# EAGLE design simduino (EAGLE 5.11)
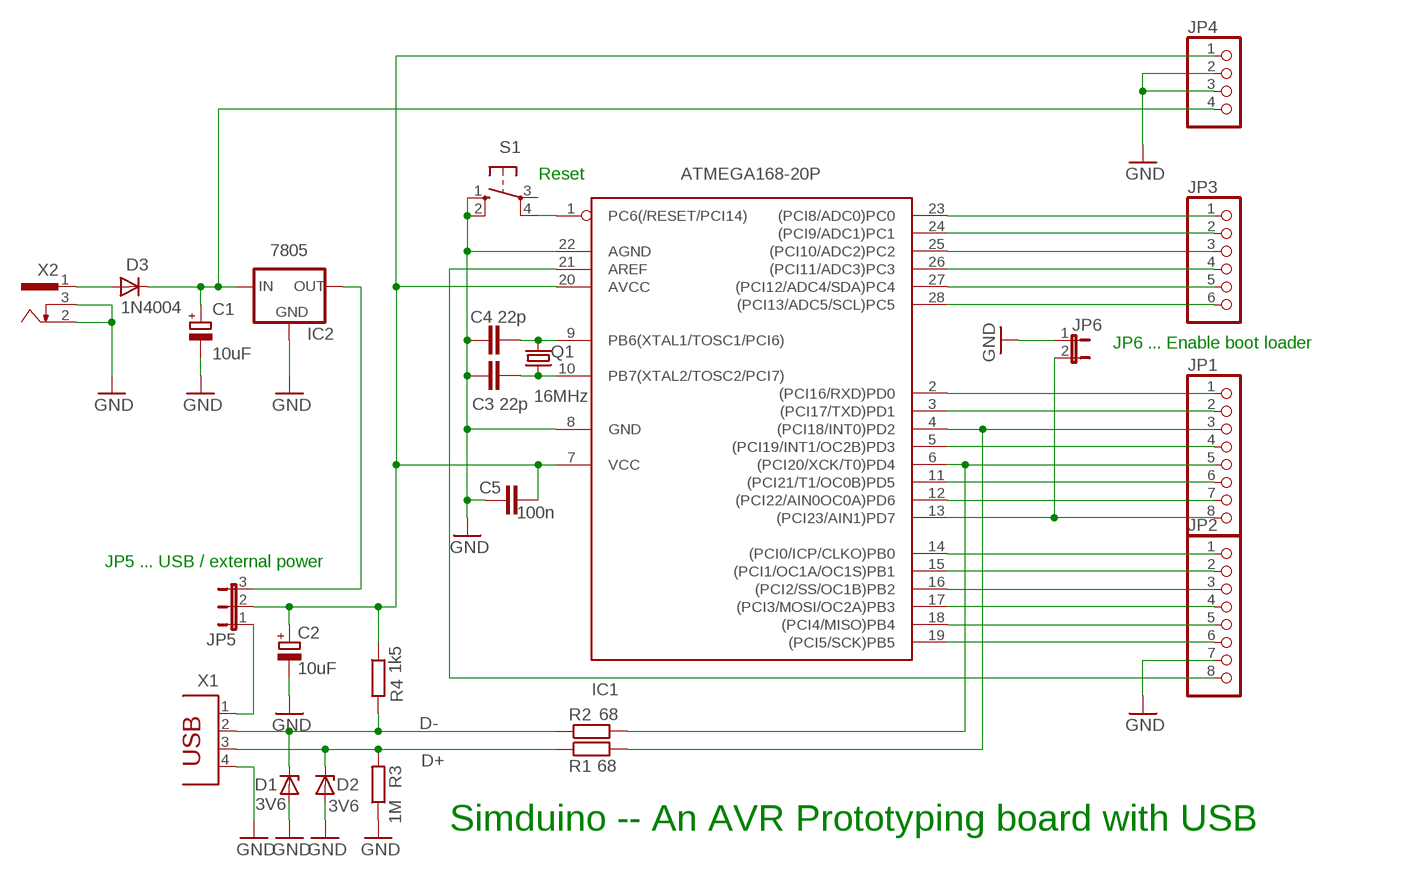
[diagram p0: schematic, sheet 1]

## Parts
C1  10uF  CPOL-EUE2,5-6E  [E2,5-6E]
C2  10uF  CPOL-EUE2,5-6E  [E2,5-6E]
C3  22p  C-EU025-024X044  [C025-024X044]
C4  22p  C-EU025-024X044  [C025-024X044]
C5  100n  C-EU025_050-025X075  [C025_050-025X075]
D1  3V6  ZENER-DIODEDO34-7  [DO34Z7]
D2  3V6  ZENER-DIODEDO34-7  [DO34Z7]
D3  1N4004  [DO41-10]
IC1  ATMEGA168-20P  [DIL28-3]
IC2  7805  78XXL  [78XXL]
JP1  PINHD-1X8  [1X08]
JP2  PINHD-1X8  [1X08]
JP3  PINHD-1X6  [1X06]
JP4  PINHD-1X4  [1X04]
JP5  JP2E  [JP2]
JP6  JP1E  [JP1]
Q1  16MHz  CRYSTALHC49S  [HC49/S]
R1  68  R-EU_0207/10  [0207/10]
R2  68  R-EU_0207/10  [0207/10]
R3  1M  R-EU_0207/10  [0207/10]
R4  1k5  R-EU_0207/10  [0207/10]
S1  10-XX  [B3F-10XX]
X1  PN61729  [PN61729]
X2  733980-62  [733980-62]

## Nets
+5USB: JP5.1 X1.1
+5V: C2.+ C5.2 IC1.7(VCC) IC1.20(AVCC) JP4.1 JP5.2 R4.1
+VRAW: C1.+ D3.C IC2.IN JP4.4
D+: D2.C R1.1 R3.2 X1.3
D-: D1.C R2.1 R4.2 X1.2
GND: C1.- C2.- C3.1 C4.1 C5.1 D1.A D2.A IC1.8(GND) IC1.22(AGND) IC2.GND JP2.7 JP4.2 JP4.3 JP6.1 R3.1 S1.1(S) S1.2(S1) X1.4 X2.2 X2.3
N$1: IC1.6((PCI20/XCK/T0)PD4) JP1.5 R2.2
N$2: IC1.1(PC6(/RESET/PCI14)) S1.4(P1)
N$3: IC1.4((PCI18/INT0)PD2) JP1.3 R1.2
N$4: D3.A X2.1
N$6: IC1.2((PCI16/RXD)PD0) JP1.1
N$8: IC2.OUT JP5.3
N$9: C3.2 IC1.10(PB7(XTAL2/TOSC2/PCI7)) Q1.1
N$10: C4.2 IC1.9(PB6(XTAL1/TOSC1/PCI6)) Q1.2
N$11: IC1.3((PCI17/TXD)PD1) JP1.2
N$12: IC1.5((PCI19/INT1/OC2B)PD3) JP1.4
N$13: IC1.11((PCI21/T1/OC0B)PD5) JP1.6
N$14: IC1.12((PCI22/AIN0OC0A)PD6) JP1.7
N$15: IC1.13((PCI23/AIN1)PD7) JP1.8 JP6.2
N$16: IC1.23((PCI8/ADC0)PC0) JP3.1
N$17: IC1.24((PCI9/ADC1)PC1) JP3.2
N$18: IC1.25((PCI10/ADC2)PC2) JP3.3
N$19: IC1.26((PCI11/ADC3)PC3) JP3.4
N$20: IC1.27((PCI12/ADC4/SDA)PC4) JP3.5
N$21: IC1.28((PCI13/ADC5/SCL)PC5) JP3.6
N$22: IC1.14((PCI0/ICP/CLKO)PB0) JP2.1
N$23: IC1.15((PCI1/OC1A/OC1S)PB1) JP2.2
N$24: IC1.16((PCI2/SS/OC1B)PB2) JP2.3
N$25: IC1.17((PCI3/MOSI/OC2A)PB3) JP2.4
N$26: IC1.18((PCI4/MISO)PB4) JP2.5
N$27: IC1.19((PCI5/SCK)PB5) JP2.6
N$28: IC1.21(AREF) JP2.8
Unconnected: S1.3(P)

## Notes on the sheet
- Reset
- JP6 ... Enable boot loader
- JP5 ... USB / external power
- Simduino -- An AVR Prototyping board with USB

## Library data of the parts
C1 C2 = rcl:CPOL-EU: POLARIZED CAPACITOR, European symbol
C3-C5 = rcl:C-EU: CAPACITOR, European symbol
D1 D2 = diode:ZENER-DIODE: Z-Diode
D3 = diode:1N4004: DIODE general purpose rectifier, 1 A
IC1 = avr:ATMEGA168*P: MICROCONTROLLER 16 kBytes FLASH 1 kBytes SRAM 512 Bytes EEPROM USART 8-channel 10 bit ADC
IC2 = v-reg:78XXL: VOLTAGE REGULATOR
JP1 JP2 = pinhead:PINHD-1X8: PIN HEADER
JP3 = pinhead:PINHD-1X6: PIN HEADER
JP4 = pinhead:PINHD-1X4: PIN HEADER
JP5 = jumper:JP2E: JUMPER
JP6 = jumper:JP1E: JUMPER
Q1 = crystal:CRYSTAL: CRYSTAL
R1-R4 = rcl:R-EU_: RESISTOR, European symbol
S1 = switch-omron:10-XX: OMRON SWITCH
X1 = con-berg:PN61729: BERG USB connector
X2 = con-conrad:73398?: FEMALE PRINT CONNECTOR Niedervolt-Steckverbinder Distributor Conrad

## Board
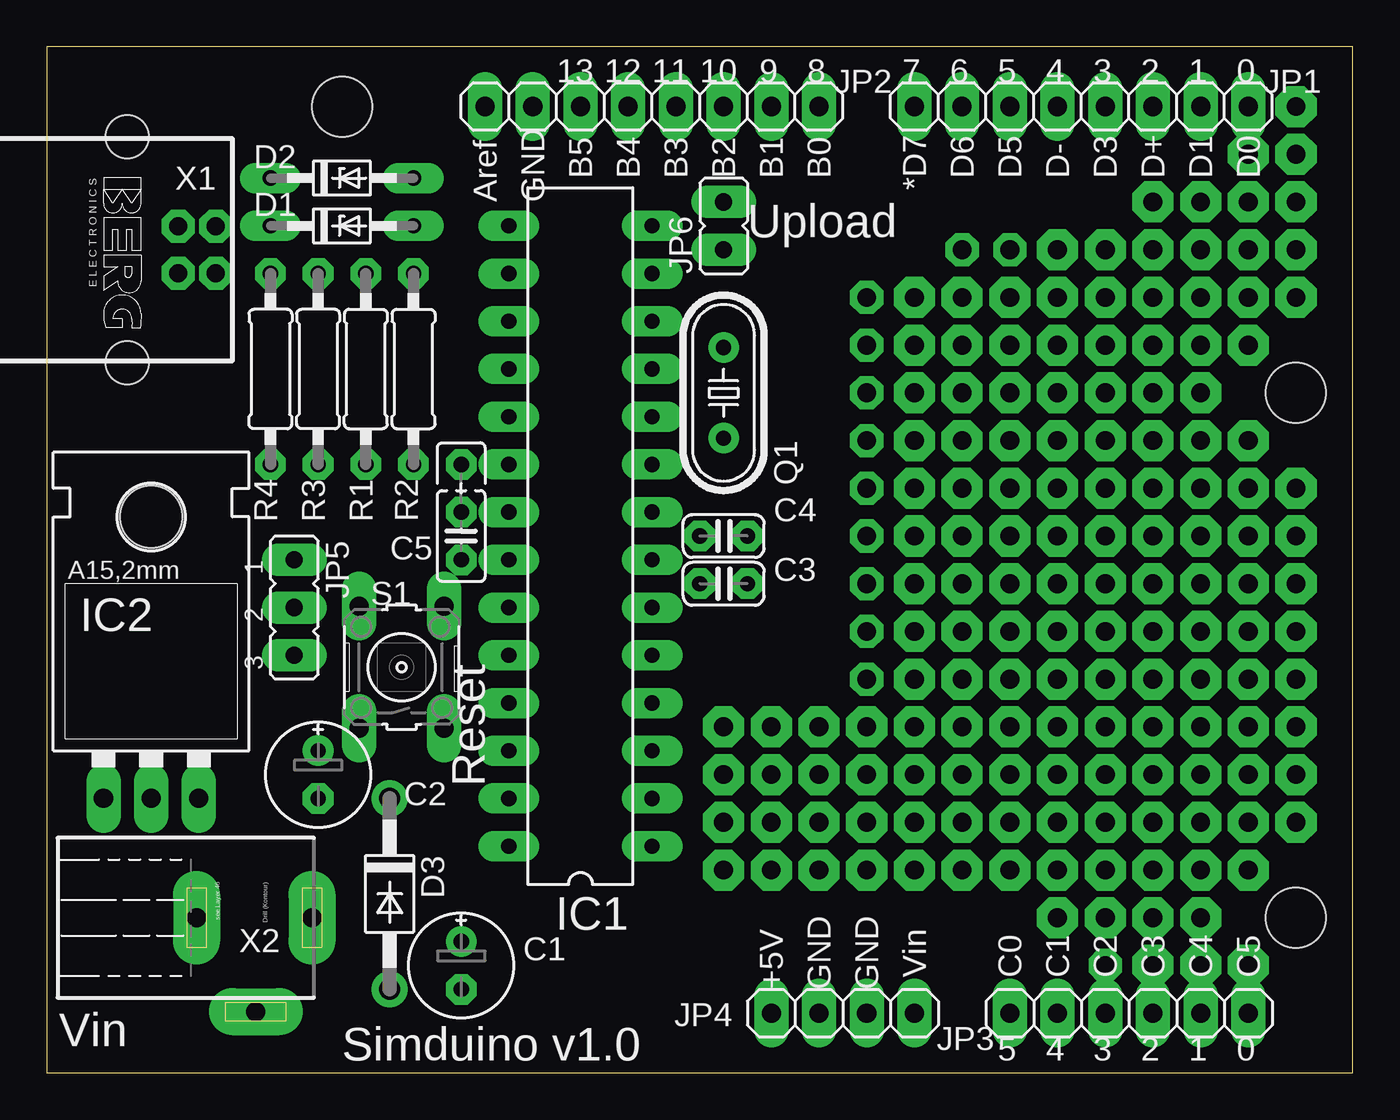
[diagram p1: board, top side]
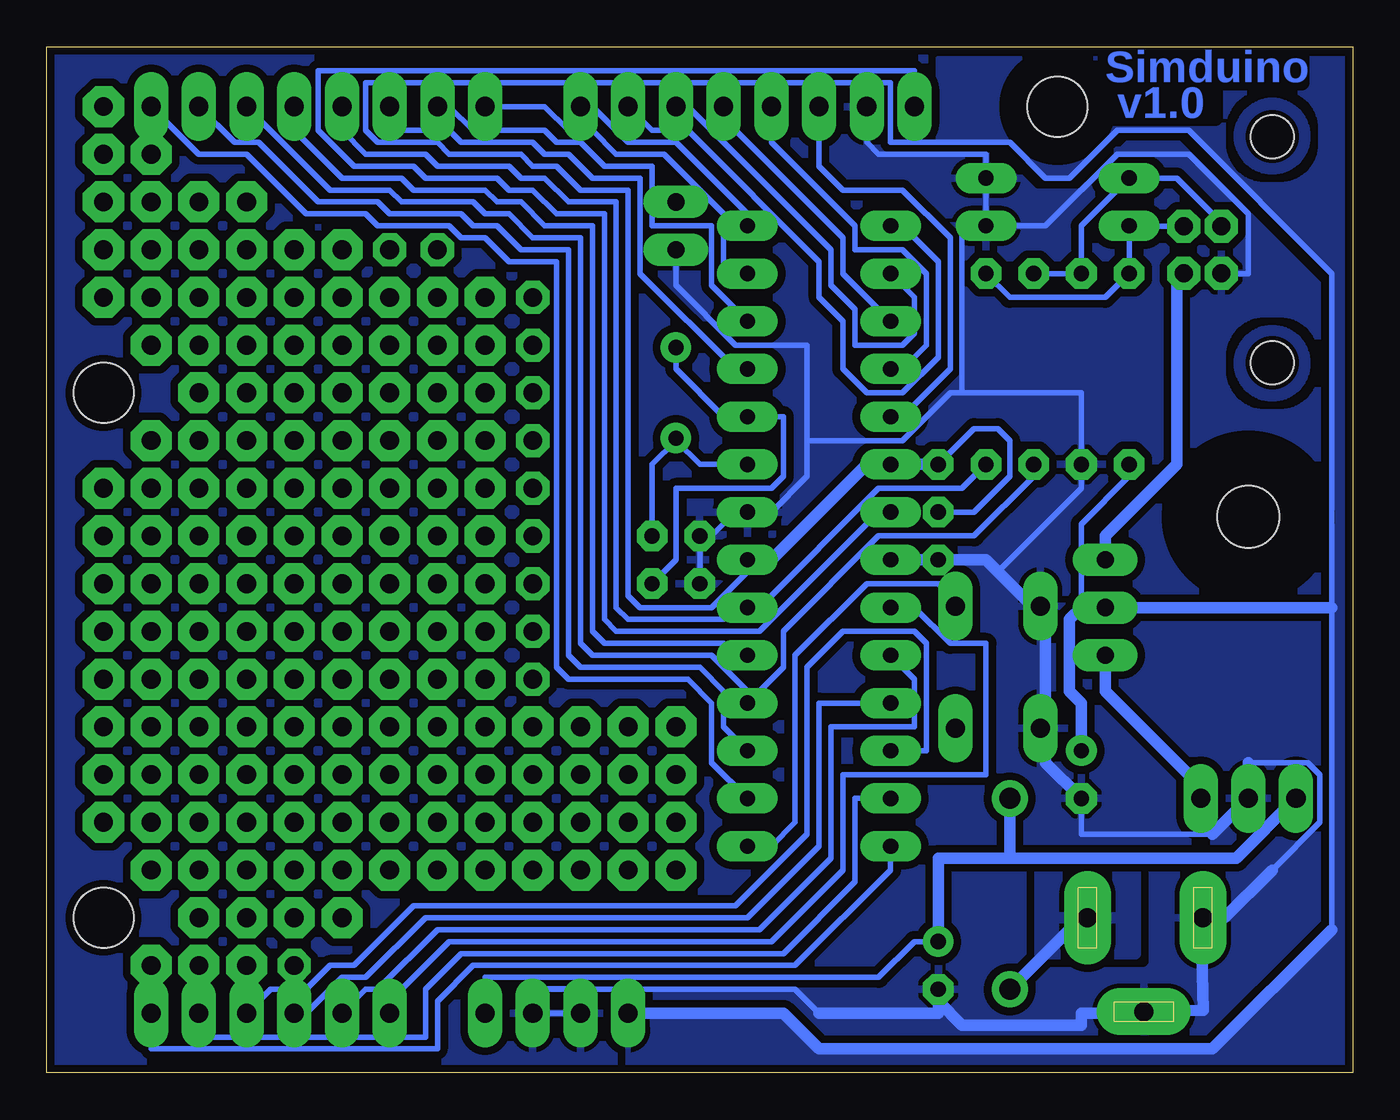
[diagram p2: board, bottom side, seen from below]

Size 69.52 x 54.6 mm. Coordinates in mm from the lower left corner, seen from the top.
Outline: 0,0 69.52,0 69.52,54.6 0,54.6 0,0
Copper layers (1*16): Top 0.035mm / dielectric 1.5mm / Bottom 0.035mm
Design rules "mine": minimum track width 12mil, minimum drill 31mil, track to track 8mil, track to pad 8mil, pad to pad 8mil, via to via 8mil, smd to smd 8mil, copper to edge 10mil, drill to drill 20mil, minimum pad ring 16mil, minimum via ring 15mil, stop-mask expansion 4mil, vias tented up to drill 0mil, thermal gap 10mil
Holes 3.2 mm at 66.51,36.19 66.51,8.25 15.71,51.43
bRestrict: area 13,48.7 to 18.4,54.1

### Footprints (pad centres in the part's own frame; a part is rotated, then mirrored left to right if it is on the bottom)
E2,5-6E = drill 0.813 pad 1.575 round: + -1.27,0 | drill 0.813 pad 1.575 octagon: - 1.27,0
C025-024X044 = drill 0.813 octagon: 1 -1.27,0; 2 1.27,0
C025_050-025X075 = drill 0.813 octagon: 1 -1.27,0; 2 1.27,0; 3 3.81,0
DO34Z7 = drill 0.813 long: A 3.81,0; C -3.81,0
DO41-10 = drill 1.118 round: A 5.08,0; C -5.08,0
DIL28-3 = drill 0.813 long: 1 -16.51,-3.81; 2 -13.97,-3.81; 3 -11.43,-3.81; 4 -8.89,-3.81; 5 -6.35,-3.81; 6 -3.81,-3.81; 7 -1.27,-3.81; 8 1.27,-3.81; 9 3.81,-3.81; 10 6.35,-3.81; 11 8.89,-3.81; 12 11.43,-3.81; 13 13.97,-3.81; 14 16.51,-3.81; 15 16.51,3.81; 16 13.97,3.81; 17 11.43,3.81; 18 8.89,3.81; 19 6.35,3.81; 20 3.81,3.81; 21 1.27,3.81; 22 -1.27,3.81; 23 -3.81,3.81; 24 -6.35,3.81; 25 -8.89,3.81; 26 -11.43,3.81; 27 -13.97,3.81; 28 -16.51,3.81
78XXL = drill 1.016 long: GND 0,-3.81; IN -2.54,-3.81; OUT 2.54,-3.81 | hole 3.302: 0,11.176
1X08 = drill 1.016 long: 1 -8.89,0; 2 -6.35,0; 3 -3.81,0; 4 -1.27,0; 5 1.27,0; 6 3.81,0; 7 6.35,0; 8 8.89,0
1X06 = drill 1.016 long: 1 -6.35,0; 2 -3.81,0; 3 -1.27,0; 4 1.27,0; 5 3.81,0; 6 6.35,0
1X04 = drill 1.016 long: 1 -3.81,0; 2 -1.27,0; 3 1.27,0; 4 3.81,0
JP2 = drill 0.914 long: 1 -2.54,0; 2 0,0; 3 2.54,0
JP1 = drill 0.914 long: 1 0,-1.27; 2 0,1.27
HC49/S = drill 0.813 round: 1 -2.413,0; 2 2.413,0
0207/10 = drill 0.813 octagon: 1 -5.08,0; 2 5.08,0
B3F-10XX = drill 1.016 long: 1 -3.251,2.261; 2 3.251,2.261; 3 -3.251,-2.261; 4 3.251,-2.261
PN61729 = drill 0.95 octagon: 1 1.25,4.71; 2 -1.25,4.71; 3 -1.25,2.71; 4 1.25,2.71 | hole 2.3: -6.02,0; 6.02,0
733980-62 = drill 1 pad 2.5 long: 1 0,8.57; 2 0,2.42; 3 5,5.57

### Placement (x,y rotation side)
C1  22.06,5.71 270 top
C2  14.44,15.87 270 top
C3  36.03,26.03 0 top
C4  36.03,28.57 0 top
C5  22.06,28.57 90 top
D1  15.71,45.08 0 top
D2  15.71,47.62 0 top
D3  18.25,9.52 270 top
IC1  28.41,28.57 90 top
IC2  5.55,18.41 0 top
JP1  55.08,51.43 180 top
JP2  32.22,51.43 180 top
JP3  57.62,3.17 0 top
JP4  42.38,3.17 0 top
JP5  13.17,24.76 270 top
JP6  36.03,45.08 0 top
Q1  36.03,36.19 270 top
R1  16.98,37.46 270 top
R2  19.52,37.46 270 top
R3  14.44,37.46 90 top
R4  11.9,37.46 90 top
S1  18.88,21.58 90 top
X1  4.28,43.81 270 top
X2  5.55,8.25 270 top

### Tracks (layer width: path | path; a pad name or v marks a point on that pad's centre or on a via)
+5USB
  Bottom 0.61: JP5.1 13.17,28.57 9.36,32.38 9.36,41.91 X1.1
+5V
  Bottom 0.305: IC1.7 32.22,26.66 34.12,24.76 37.94,24.76 38.57,25.39 38.57,46.98 41.11,46.98 42.38,48.26 43.65,48.26 44.28,48.89 48.09,48.89 48.73,49.53 51.91,49.53 52.54,50.16 52.54,52.7 24.6,52.7 24.6,49.53 18.25,49.53 16.34,47.62 15.08,47.62 12.54,50.16 8.73,50.16 1.1,42.54 1.1,24.76 1.1,7.62 | 14.44,24.76 14.44,29.2 11.9,31.74 R4.1 | C5.2 20.15,29.84 18.25,31.74 18.25,33.65 18.88,34.29 20.15,34.29 22.06,32.38
  Bottom 0.61: IC1.7 30.95,27.3 25.87,32.38 IC1.20 22.06,32.38 | JP4.1 30.31,3.17 28.41,1.27 7.46,1.27 1.1,7.62 | C2.+ 14.44,19.68 15.08,20.31 15.08,24.12 14.44,24.76 JP5.2 1.1,24.76
  pour Bottom (isolate 0.406): 0.47,42.54 0.47,7.62 1.1,7.62 1.1,42.54
  pour Bottom (isolate 0.406, rank 2): 0.47,42.54 0.47,53.97 22.06,53.97 22.06,49.53 18.25,49.53 16.34,47.62 15.08,47.62 12.54,50.16 8.73,50.16 1.1,42.54
  pour Bottom (isolate 0.406, rank 2): 1.74,6.98 7.46,1.27 28.41,1.27 30.31,3.17 38.57,3.17 38.57,-0.01 -0.17,-0.01 -0.17,7.62 1.1,7.62
+VRAW
  Bottom 0.305: JP4.4 46.19,5.08 25.23,5.08 23.33,6.98 C1.+
  Bottom 0.61: IC2.IN 6.18,11.43 18.25,11.43 | 18.25,11.43 22.06,11.43 C1.+ | 18.25,11.43 D3.C
D+
  Bottom 0.305: R1.1 R3.2 14.44,45.08 D2.C 9.36,47.62 6.99,45.25 X1.3
D-
  Bottom 0.305: R2.1 18.25,41.27 13.17,41.27 R4.2 11.88,42.56 11.88,45.06 | 11.88,45.06 X1.2 | 11.88,45.06 D1.C
GND
  Bottom 0.305: C5.1 IC1.22 | JP4.3 JP4.2 41.11,4.44 29.68,4.44 28.41,3.17 | C2.- 14.44,12.7 7.46,12.7 | 5.55,16.5 2.38,16.5 1.74,15.87 1.74,13.33 4.28,10.79 | C3.1 C4.1 34.12,28.57 32.85,29.84 IC1.8 30.95,29.84 29.04,31.74 29.04,33.65 | JP6.1 36.03,41.91 32.85,38.73 29.04,38.73 29.04,33.65 | 29.04,33.65 23.96,33.65 21.42,36.19 20.79,36.19 | JP2.7 25.87,49.53 25.23,48.89 19.52,48.89 D2.A | 20.79,36.19 14.44,36.19 R3.1 14.44,31.11 18.88,26.66 | 20.79,36.19 20.79,45.08 D1.A | D1.A D2.A | D1.A D2.A | D1.A 16.34,45.08 12.54,48.89 8.73,48.89 5.55,45.72 5.55,42.54 6.82,42.54 X1.4
  Bottom 0.308: 41.11,4.44 43.65,4.44 JP4.3
  Bottom 0.61: IC1.22 C5.1 19.52,27.3 18.88,26.66 16.98,24.76 | S1.2 16.9,24.84 16.98,24.76 | 16.98,24.76 16.34,24.12 16.34,18.41 | S1.1 16.42,18.33 16.34,18.41 | 16.34,18.41 16.34,16.5 C2.- | 28.41,3.17 22.06,3.17 C1.- 22.06,3.8 20.79,2.54 14.44,2.54 14.44,3.17 11.27,3.17 11.19,3.25 X2.3 7.94,3.31 8.09,8.25 | 7.46,12.7 IC2.GND 5.55,16.5 | 4.28,10.79 6.82,8.25 8.09,8.25 | 8.09,8.25 X2.2
  pour Bottom (isolate 0.406, rank 3): -0.17,54.61 69.69,54.61 69.69,-0.01 -0.17,-0.01
N$1
  Bottom 0.305: JP1.5 53.81,50.16 52.54,48.89 49.37,48.89 48.73,48.26 44.92,48.26 44.28,47.62 43.02,47.62 41.74,46.35 39.2,46.35 39.2,24.76 38.57,24.12 33.49,24.12 32.85,24.76 IC1.6 31.58,24.76 25.23,31.11 20.79,31.11 R2.2
N$2
  Bottom 0.305: IC1.1 30.95,12.06 29.68,13.33 29.68,22.22 25.87,26.03 22.06,26.03 21.42,25.39 S1.4
N$3
  Bottom 0.305: JP1.3 54.45,46.98 51.27,46.98 50.63,46.35 46.82,46.35 46.19,45.72 44.92,45.72 43.65,44.45 41.11,44.45 41.11,22.86 40.48,22.22 34.12,22.22 32.22,20.31 IC1.4 30.31,21.58 30.31,23.49 25.23,28.57 20.15,28.57 16.98,31.74 R1.2
N$4
  Bottom 0.61: X2.1 14.44,8.25 D3.A
  pour Bottom (isolate 0.406): 11.57,10.79 16.65,10.79 16.65,6.34 11.57,6.34
N$5  (via drill 1 pad 2.18)
  other vias: 63.97,48.89
N$6
  Bottom 0.305: IC1.2 34.12,16.5 34.12,19.68 35.39,20.95 41.74,20.95 42.38,21.58 42.38,43.18 44.92,43.18 46.19,44.45 47.46,44.45 48.09,45.08 51.91,45.08 52.54,45.72 55.71,45.72 58.89,48.89 61.43,48.89 JP1.1
N$7  (via drill 1 pad 2.18)
  other vias: 63.97,46.35
N$8
  Bottom 0.61: JP5.3 13.17,20.31 8.09,15.24 IC2.OUT
N$9
  Bottom 0.305: 36.03,38.73 Q1.1 36.03,37.46 33.49,34.92 IC1.10 30.31,34.92 30.31,31.74 30.95,31.11 36.03,31.11 36.03,27.3 C3.2
N$10
  Bottom 0.305: IC1.9 34.76,32.38 36.03,33.65 | 36.03,33.65 Q1.2 | C4.2 37.3,32.38 36.03,33.65
N$11
  Bottom 0.305: IC1.3 33.49,18.41 33.49,20.31 34.76,21.58 41.11,21.58 41.74,22.22 41.74,43.81 44.28,43.81 45.55,45.08 46.82,45.08 47.46,45.72 51.27,45.72 51.91,46.35 55.08,46.35 58.25,49.53 59.52,49.53 JP1.2
N$12
  Bottom 0.305: IC1.5 32.85,22.22 33.49,22.86 39.84,22.86 40.48,23.49 40.48,45.08 43.02,45.08 44.28,46.35 45.55,46.35 46.19,46.98 50,46.98 50.63,47.62 53.81,47.62 56.35,50.16 JP1.4
N$13
  Bottom 0.305: JP1.6 51.27,50.16 48.09,50.16 47.46,49.53 43.65,49.53 43.02,48.89 41.74,48.89 40.48,47.62 37.94,47.62 37.94,42.54 32.85,37.46 IC1.11
N$14
  Bottom 0.305: JP1.7 48.09,51.43 46.82,50.16 43.02,50.16 42.38,49.53 41.11,49.53 39.84,48.26 37.3,48.26 37.3,45.08 34.12,45.08 34.12,41.91 IC1.12
N$15
  Bottom 0.305: IC1.13 33.49,42.54 33.49,45.72 34.76,46.98 | JP1.8 43.02,51.43 41.74,50.16 40.48,50.16 39.2,48.89 36.66,48.89 34.76,46.98 | JP6.2 35.39,46.35 34.76,46.98
N$16
  Bottom 0.305: IC1.23 23.33,24.76 21.42,22.86 19.52,22.86 19.52,15.87 27.14,15.87 27.14,10.79 30.95,6.98 48.09,6.98 51.27,3.8 JP3.1
N$17
  Bottom 0.305: IC1.24 23.33,20.95 23.33,18.41 27.77,18.41 27.77,11.43 31.58,7.62 48.73,7.62 51.91,4.44 52.54,4.44 JP3.2
N$18
  Bottom 0.305: JP3.3 55.71,3.17 53.81,5.08 52.54,5.08 49.37,8.25 32.22,8.25 28.41,12.06 28.41,19.68 IC1.25
N$19
  Bottom 0.305: IC1.26 22.7,17.14 22.7,22.86 23.33,23.49 27.14,23.49 29.04,21.58 29.04,12.7 32.85,8.89 50,8.89 53.17,5.71 54.45,5.71 55.71,4.44 57.62,4.44 JP3.4
N$20
  Bottom 0.305: IC1.27 26.5,14.6 26.5,10.16 30.31,6.34 47.46,6.34 49.37,4.44 49.37,1.9 61.43,1.9 JP3.5
N$21
  Bottom 0.305: IC1.28 24.6,10.79 29.68,5.71 46.82,5.71 48.73,3.8 48.73,1.27 63.97,1.27 JP3.6
N$22
  Bottom 0.305: IC1.14 32.22,45.72 36.03,49.53 38.57,49.53 40.48,51.43 JP2.1
N$23
  Bottom 0.305: JP2.2 37.3,50.16 35.39,50.16 28.41,43.18 28.41,41.27 27.14,40 27.14,37.46 25.87,36.19 23.96,36.19 22.06,38.1 22.06,43.18 23.96,45.08 IC1.15
N$24
  Bottom 0.305: JP2.3 35.39,51.43 27.77,43.81 27.77,41.91 26.5,40.64 26.5,38.73 23.96,38.73 23.33,39.37 23.33,41.27 IC1.16
N$25
  Bottom 0.305: IC1.17 27.14,42.54 27.14,44.45 33.49,50.8 JP2.4
N$26
  Bottom 0.305: IC1.18 23.96,37.46 22.7,38.73 22.7,42.54 23.96,43.81 26.5,43.81 26.5,45.08 30.95,49.53 JP2.5
N$27
  Bottom 0.305: IC1.19 23.96,34.92 21.42,37.46 21.42,44.45 23.96,46.98 27.14,46.98 28.41,48.26 JP2.6
N$28
  Bottom 0.305: IC1.21 25.23,29.84 31.58,23.49 39.2,23.49 39.84,24.12 39.84,45.72 42.38,45.72 43.65,46.98 44.92,46.98 45.55,47.62 49.37,47.62 50,48.26 53.17,48.26 55.08,50.16 55.08,53.34 23.33,53.34 JP2.8
N$29  (via drill 1 pad 2.18)
  other vias: 63.97,43.81
N$30  (via drill 1 pad 2.18)
  other vias: 63.97,41.27
N$31  (via drill 1 pad 2.18)
  other vias: 66.51,41.27
N$32  (via drill 1 pad 2.18)
  other vias: 66.51,43.81
N$33  (via drill 1 pad 2.18)
  other vias: 66.51,46.35
N$34  (via drill 1 pad 2.18)
  other vias: 66.51,48.89
N$35  (via drill 1 pad 2.18)
  other vias: 63.97,38.73
N$36  (via drill 1 pad 2.18)
  other vias: 61.43,38.73
N$37  (via drill 1 pad 2.18)
  other vias: 61.43,41.27
N$38  (via drill 1 pad 2.18)
  other vias: 61.43,43.81
N$39  (via drill 1 pad 2.18)
  other vias: 61.43,46.35
N$40  (via drill 1 pad 2.18)
  other vias: 58.89,46.35
N$41  (via drill 1 pad 2.18)
  other vias: 58.89,43.81
N$42  (via drill 1 pad 2.18)
  other vias: 58.89,41.27
N$43  (via drill 1 pad 2.18)
  other vias: 58.89,38.73
N$44  (via drill 1 pad 2.18)
  other vias: 56.35,38.73
N$45  (via drill 1 pad 2.18)
  other vias: 56.35,41.27
N$46  (via drill 1 pad 2.18)
  other vias: 56.35,43.81
N$47  (via drill 1 pad 2.18)
  other vias: 53.81,41.27
N$48  (via drill 1 pad 2.18)
  other vias: 53.81,38.73
N$49  (via drill 1 pad 2.18)
  other vias: 51.27,38.73
N$50  (via drill 1 pad 2.18)
  other vias: 51.27,41.27
N$51  (via drill 1 pad 2.18)
  other vias: 48.73,41.27
N$52  (via drill 1 pad 2.18)
  other vias: 46.19,41.27
N$53  (via drill 1 pad 2.18)
  other vias: 46.19,38.73
N$54  (via drill 1 pad 2.18)
  other vias: 48.73,38.73
N$55  (via drill 1 pad 2.18)
  other vias: 46.19,36.19
N$56  (via drill 1 pad 2.18)
  other vias: 48.73,36.19
N$57  (via drill 1 pad 2.18)
  other vias: 51.27,36.19
N$58  (via drill 1 pad 2.18)
  other vias: 53.81,36.19
N$59  (via drill 1 pad 2.18)
  other vias: 56.35,36.19
N$60  (via drill 1 pad 2.18)
  other vias: 58.89,36.19
N$61  (via drill 1 pad 2.18)
  other vias: 61.43,36.19
N$62  (via drill 1)
  other vias: 56.35,5.71
N$63  (via drill 1 pad 2.18)
  other vias: 46.19,26.03
N$64  (via drill 1 pad 2.18)
  other vias: 46.19,33.65
N$65  (via drill 1 pad 2.18)
  other vias: 48.73,33.65
N$66  (via drill 1 pad 2.18)
  other vias: 51.27,33.65
N$67  (via drill 1 pad 2.18)
  other vias: 53.81,33.65
N$68  (via drill 1 pad 2.18)
  other vias: 56.35,33.65
N$69  (via drill 1 pad 2.18)
  other vias: 58.89,33.65
N$70  (via drill 1 pad 2.18)
  other vias: 61.43,33.65
N$71  (via drill 1 pad 2.18)
  other vias: 63.97,33.65
N$72  (via drill 1)
  other vias: 43.65,41.27
N$73  (via drill 1 pad 2.18)
  other vias: 46.19,31.11
N$74  (via drill 1 pad 2.18)
  other vias: 48.73,31.11
N$75  (via drill 1 pad 2.18)
  other vias: 51.27,31.11
N$76  (via drill 1 pad 2.18)
  other vias: 53.81,31.11
N$77  (via drill 1 pad 2.18)
  other vias: 56.35,31.11
N$78  (via drill 1 pad 2.18)
  other vias: 58.89,31.11
N$79  (via drill 1 pad 2.18)
  other vias: 61.43,31.11
N$80  (via drill 1 pad 2.18)
  other vias: 63.97,31.11
N$81  (via drill 1 pad 2.18)
  other vias: 66.51,31.11
N$82  (via drill 1 pad 2.18)
  other vias: 46.19,28.57
N$83  (via drill 1 pad 2.18)
  other vias: 48.73,28.57
N$84  (via drill 1 pad 2.18)
  other vias: 51.27,28.57
N$85  (via drill 1 pad 2.18)
  other vias: 53.81,28.57
N$86  (via drill 1 pad 2.18)
  other vias: 56.35,28.57
N$87  (via drill 1 pad 2.18)
  other vias: 58.89,28.57
N$88  (via drill 1 pad 2.18)
  other vias: 61.43,28.57
N$89  (via drill 1 pad 2.18)
  other vias: 63.97,28.57
N$90  (via drill 1 pad 2.18)
  other vias: 66.51,28.57
N$91  (via drill 1 pad 2.18)
  other vias: 66.51,26.03
N$92  (via drill 1 pad 2.18)
  other vias: 63.97,26.03
N$93  (via drill 1 pad 2.18)
  other vias: 61.43,26.03
N$94  (via drill 1 pad 2.18)
  other vias: 58.89,26.03
N$95  (via drill 1 pad 2.18)
  other vias: 56.35,26.03
N$96  (via drill 1 pad 2.18)
  other vias: 53.81,26.03
N$97  (via drill 1 pad 2.18)
  other vias: 51.27,26.03
N$98  (via drill 1 pad 2.18)
  other vias: 48.73,26.03
N$99  (via drill 1)
  other vias: 43.65,38.73
N$100  (via drill 1 pad 2.18)
  other vias: 46.19,23.49
N$101  (via drill 1 pad 2.18)
  other vias: 48.73,23.49
N$102  (via drill 1 pad 2.18)
  other vias: 51.27,23.49
N$103  (via drill 1 pad 2.18)
  other vias: 53.81,23.49
N$104  (via drill 1 pad 2.18)
  other vias: 56.35,23.49
N$105  (via drill 1 pad 2.18)
  other vias: 58.89,23.49
N$106  (via drill 1 pad 2.18)
  other vias: 61.43,23.49
N$107  (via drill 1 pad 2.18)
  other vias: 63.97,23.49
N$108  (via drill 1 pad 2.18)
  other vias: 66.51,23.49
N$109  (via drill 1 pad 2.18)
  other vias: 46.19,20.95
N$110  (via drill 1 pad 2.18)
  other vias: 48.73,20.95
N$111  (via drill 1 pad 2.18)
  other vias: 51.27,20.95
N$112  (via drill 1 pad 2.18)
  other vias: 53.81,20.95
N$113  (via drill 1 pad 2.18)
  other vias: 56.35,20.95
N$114  (via drill 1 pad 2.18)
  other vias: 58.89,20.95
N$115  (via drill 1 pad 2.18)
  other vias: 61.43,20.95
N$116  (via drill 1 pad 2.18)
  other vias: 63.97,20.95
N$117  (via drill 1 pad 2.18)
  other vias: 66.51,20.95
N$118  (via drill 1 pad 2.18)
  other vias: 66.51,18.41
N$119  (via drill 1 pad 2.18)
  other vias: 63.97,18.41
N$120  (via drill 1 pad 2.18)
  other vias: 61.43,18.41
N$121  (via drill 1 pad 2.18)
  other vias: 58.89,18.41
N$122  (via drill 1 pad 2.18)
  other vias: 56.35,18.41
N$123  (via drill 1 pad 2.18)
  other vias: 53.81,18.41
N$124  (via drill 1 pad 2.18)
  other vias: 51.27,18.41
N$125  (via drill 1 pad 2.18)
  other vias: 48.73,18.41
N$126  (via drill 1 pad 2.18)
  other vias: 46.19,18.41
N$127  (via drill 1 pad 2.18)
  other vias: 43.65,18.41
N$128  (via drill 1 pad 2.18)
  other vias: 41.11,18.41
N$129  (via drill 1 pad 2.18)
  other vias: 38.57,18.41
N$130  (via drill 1 pad 2.18)
  other vias: 36.03,18.41
N$131  (via drill 1 pad 2.18)
  other vias: 36.03,15.87
N$132  (via drill 1 pad 2.18)
  other vias: 38.57,15.87
N$133  (via drill 1 pad 2.18)
  other vias: 41.11,15.87
N$134  (via drill 1 pad 2.18)
  other vias: 43.65,15.87
N$135  (via drill 1 pad 2.18)
  other vias: 46.19,15.87
N$136  (via drill 1 pad 2.18)
  other vias: 48.73,15.87
N$137  (via drill 1 pad 2.18)
  other vias: 51.27,15.87
N$138  (via drill 1 pad 2.18)
  other vias: 53.81,15.87
N$139  (via drill 1 pad 2.18)
  other vias: 56.35,15.87
N$140  (via drill 1 pad 2.18)
  other vias: 58.89,15.87
N$141  (via drill 1 pad 2.18)
  other vias: 61.43,15.87
N$142  (via drill 1 pad 2.18)
  other vias: 63.97,15.87
N$143  (via drill 1 pad 2.18)
  other vias: 66.51,15.87
N$144  (via drill 1 pad 2.18)
  other vias: 66.51,13.33
N$145  (via drill 1 pad 2.18)
  other vias: 63.97,13.33
N$146  (via drill 1 pad 2.18)
  other vias: 61.43,13.33
N$147  (via drill 1 pad 2.18)
  other vias: 58.89,13.33
N$148  (via drill 1 pad 2.18)
  other vias: 56.35,13.33
N$149  (via drill 1 pad 2.18)
  other vias: 53.81,13.33
N$150  (via drill 1 pad 2.18)
  other vias: 51.27,13.33
N$151  (via drill 1 pad 2.18)
  other vias: 48.73,13.33
N$152  (via drill 1 pad 2.18)
  other vias: 46.19,13.33
N$153  (via drill 1 pad 2.18)
  other vias: 43.65,13.33
N$154  (via drill 1 pad 2.18)
  other vias: 41.11,13.33
N$155  (via drill 1 pad 2.18)
  other vias: 38.57,13.33
N$156  (via drill 1 pad 2.18)
  other vias: 36.03,13.33
N$157  (via drill 1 pad 2.18)
  other vias: 36.03,10.79
N$158  (via drill 1 pad 2.18)
  other vias: 38.57,10.79
N$159  (via drill 1 pad 2.18)
  other vias: 41.11,10.79
N$160  (via drill 1 pad 2.18)
  other vias: 43.65,10.79
N$161  (via drill 1 pad 2.18)
  other vias: 46.19,10.79
N$162  (via drill 1 pad 2.18)
  other vias: 48.73,10.79
N$163  (via drill 1 pad 2.18)
  other vias: 51.27,10.79
N$164  (via drill 1 pad 2.18)
  other vias: 53.81,10.79
N$165  (via drill 1 pad 2.18)
  other vias: 56.35,10.79
N$166  (via drill 1 pad 2.18)
  other vias: 58.89,10.79
N$167  (via drill 1 pad 2.18)
  other vias: 61.43,10.79
N$168  (via drill 1 pad 2.18)
  other vias: 63.97,10.79
N$169  (via drill 1)
  other vias: 43.65,36.19
N$170  (via drill 1)
  other vias: 43.65,33.65
N$171  (via drill 1 pad 2.18)
  other vias: 61.43,8.25
N$172  (via drill 1 pad 2.18)
  other vias: 58.89,8.25
N$173  (via drill 1 pad 2.18)
  other vias: 56.35,8.25
N$174  (via drill 1 pad 2.18)
  other vias: 53.81,8.25
N$175  (via drill 1 pad 2.18)
  other vias: 61.43,5.71
N$176  (via drill 1 pad 2.18)
  other vias: 63.97,5.71
N$177  (via drill 1 pad 2.18)
  other vias: 58.89,5.71
N$178  (via drill 1)
  other vias: 43.65,31.11
N$179  (via drill 1 pad 2.18)
  other vias: 66.51,51.43
N$180  (via drill 1 pad 2.18)
  other vias: 53.81,43.81
N$181  (via drill 1)
  other vias: 51.27,43.81
N$182  (via drill 1)
  other vias: 43.65,28.57
N$183  (via drill 1)
  other vias: 43.65,26.03
N$184  (via drill 1)
  other vias: 43.65,23.49
N$185  (via drill 1)
  other vias: 43.65,20.95
N$186  (via drill 1)
  other vias: 48.73,43.81
N$187
  pour Bottom (isolate 2.54, no thermals): 43.65,41.27 46.19,41.27 48.73,43.81 56.35,43.81 58.89,46.35 61.43,46.35 67.78,52.7 67.78,5.71 56.35,5.71 51.27,10.79 36.03,10.79 36.03,18.41 41.11,18.41 43.65,20.95
N$188
  pour Bottom: 4.28,51.76 arc-90 6.18,49.86 arc-90 4.28,47.95 arc-90 2.38,49.86 arc-90
  pour Bottom: 4.28,39.67 arc-90 6.18,37.76 arc-90 4.28,35.86 arc-90 2.38,37.76 arc-90

### Text on the board
Bottom: Simduino | v1.0
tPlace: 13 | 12 | 11 | 10 | 9 | 8 | 7 | 6 | 5 | 4 | 3 | 2 | 1 | 0 | B5 | B4 | B3 | B2 | B1 | B0 | D6 | D5 | D- | D3 | D+ | D1 | D0 | Aref | GND | *D7 | Upload | Reset | +5V | GND | GND | Vin | C0 | C1 | C2 | C3 | C4 | C5 | Vin | Simduino v1.0 | 5 | 4 | 3 | 2 | 1 | 0